# Altium project DAF DIP-4 PCB.PrjPcb
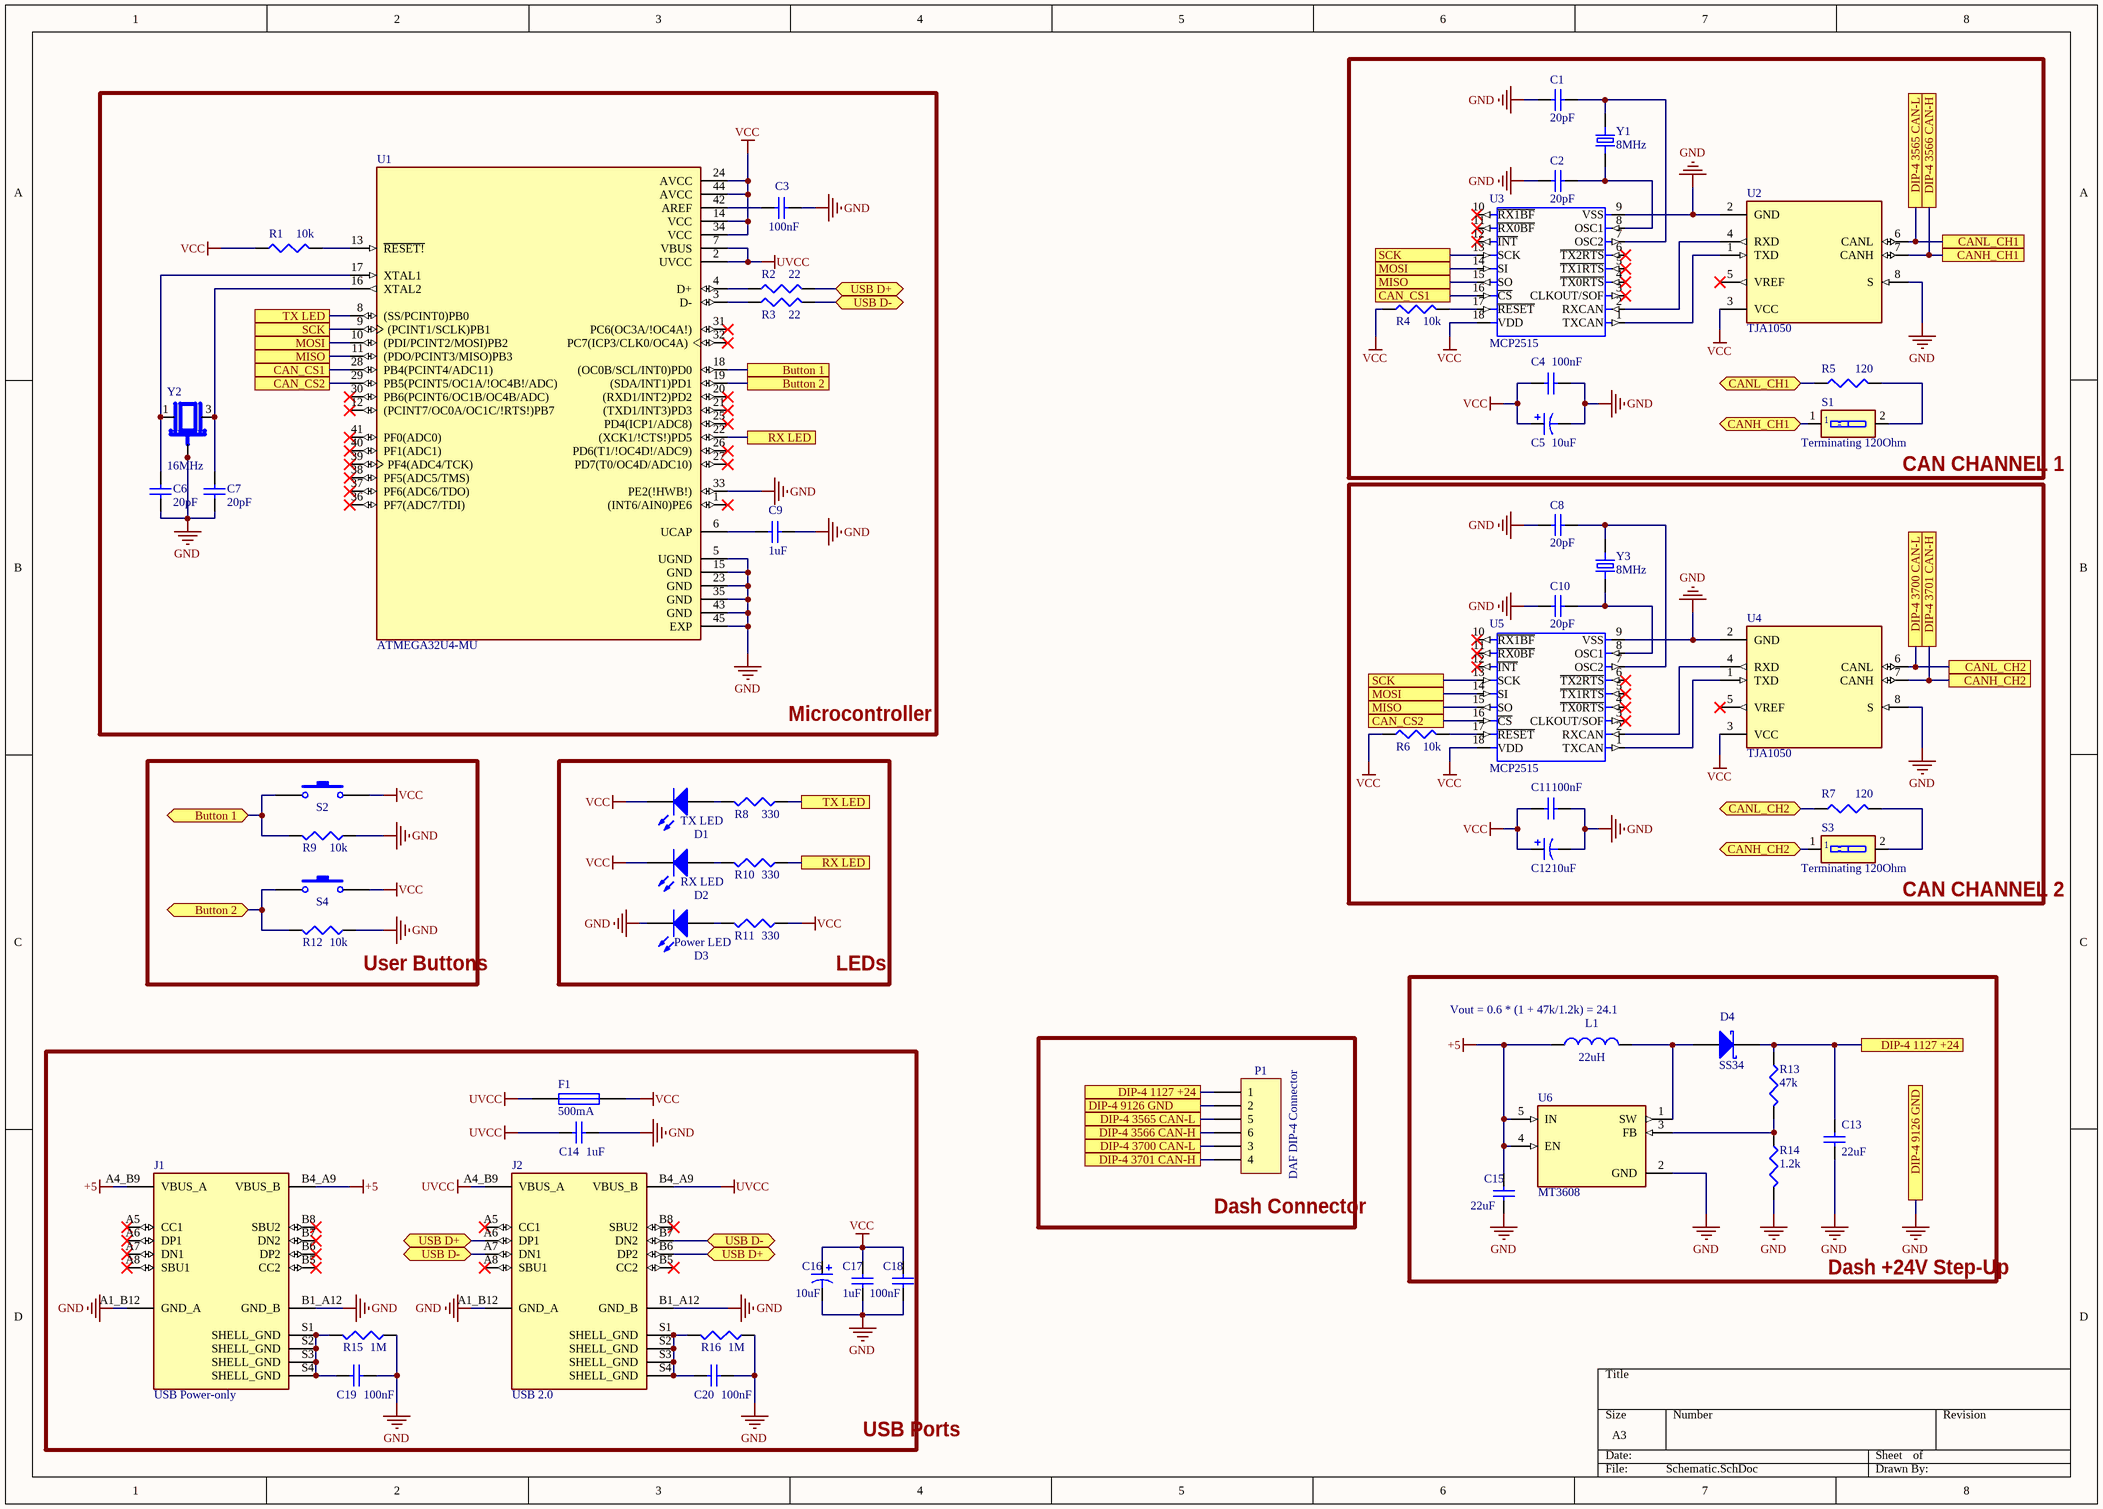
[diagram p0: Schematic.SchDoc]
1 sheet, 58 parts. Net scope: flat (ports and power ports of the same name join across sheets).
Board file: DAF DIP-4 PCB.PcbDoc

## Sheet Schematic.SchDoc: DAF DIP-4 Dashboard Controller
size A3; DrawnBy: Nazar Diadiun; SheetNumber: 1; SheetTotal: 1

### Parts
C1  value 20pF  [C0805]  (hidden comment: Cap)
C2  value 20pF  [C0805]  (hidden comment: Cap)
C3  value 100nF  [C0805]  (hidden comment: Cap)
C4  value 100nF  [C0805]  (hidden comment: Cap)
C5  value 10uF  [C1206]  (hidden comment: Cap Pol3)
C6  value 20pF  [C0805]  (hidden comment: Cap)
C7  value 20pF  [C0805]  (hidden comment: Cap)
C8  value 20pF  [C0805]  (hidden comment: Cap)
C9  value 1uF  [C0805]  (hidden comment: Cap)
C10  value 20pF  [C0805]  (hidden comment: Cap)
C11  value 100nF  [C0805]  (hidden comment: Cap)
C12  value 10uF  [C1206]  (hidden comment: Cap Pol3)
C13  value 22uF  [C1206]  (hidden comment: Cap)
C14  value 1uF  [C0805]  (hidden comment: Cap)
C15  value 22uF  [C1206]  (hidden comment: Cap)
C16  value 10uF  [C1206]  (hidden comment: Cap Pol3)
C17  value 1uF  [C0805]  (hidden comment: Cap)
C18  value 100nF  [C0805]  (hidden comment: Cap)
C19  value 100nF  [C0805]  (hidden comment: Cap)
C20  value 100nF  [C0805]  (hidden comment: Cap)
D1  TX LED  [6-0805_L]
D2  RX LED  [6-0805_L]
D3  Power LED  [6-0805_L]
D4  SS34  [SMC]
F1  500mA  [C1206]
J1  USB Power-only  [GCT_USB4505-03-0-A_REVA]
J2  USB 2.0  [GCT_USB4505-03-0-A_REVA]
L1  value 22uH  [IND_#B966BS-220M=P3]  (hidden comment: Inductor)
P1  DAF DIP-4 Connector  [HDR1X6]
R1  value 10k  [6-0805_L]  (hidden comment: Res3)
R2  value 22  [J1-0603]  (hidden comment: Res3)
R3  value 22  [J1-0603]  (hidden comment: Res3)
R4  value 10k  [6-0805_L]  (hidden comment: Res3)
R5  value 120  [6-0805_L]  (hidden comment: Res3)
R6  value 10k  [6-0805_L]  (hidden comment: Res3)
R7  value 120  [6-0805_L]  (hidden comment: Res3)
R8  value 330  [6-0805_L]  (hidden comment: Res3)
R9  value 10k  [6-0805_L]  (hidden comment: Res3)
R10  value 330  [6-0805_L]  (hidden comment: Res3)
R11  value 330  [6-0805_L]  (hidden comment: Res3)
R12  value 10k  [6-0805_L]  (hidden comment: Res3)
R13  value 47k  [6-0805_L]  (hidden comment: Res3)
R14  value 1.2k  [6-0805_L]  (hidden comment: Res3)
R15  value 1M  [6-0805_L]  (hidden comment: Res3)
R16  value 1M  [6-0805_L]  (hidden comment: Res3)
S1  Terminating 120Ohm  [SW_5161390-1]
S2  SW-PB  [SW_147873-2]  (value not drawn)
S3  Terminating 120Ohm  [SW_5161390-1]
S4  SW-PB  [SW_147873-2]  (value not drawn)
U1  ATMEGA32U4-MU  [QFN50P700X700X100-45N]
U2  TJA1050  [SOIC127P600X175-8N]
U3  MCP2515  [SOIC18-1.27-11.5X7.5MM]
U4  TJA1050  [SOIC127P600X175-8N]
U5  MCP2515  [SOIC18-1.27-11.5X7.5MM]
U6  MT3608  [SOT95P280X145-6N]
Y1  8MHz  [XTAL_ECS-135-S-1]
Y2  16MHz  [OSC_ABM3B-16.000MHZ-D-1-X-T]
Y3  8MHz  [XTAL_ECS-135-S-1]

### Blocks framed on the sheet
CAN CHANNEL 1: C1 C2 C4 C5 R4 R5 S1 U2 U3 Y1
Microcontroller: C3 C6 C7 C9 R1-R3 U1 Y2
User Buttons: R9 R12 S2 S4
LEDs: D1-D3 R8 R10 R11
Dash +24V Step-Up: C13 C15 D4 L1 R13 R14 U6
Dash Connector: P1
USB Ports: C14 C16-C20 F1 J1 J2 R15 R16

### Ports
Button 1, Button 1 (bidir), Button 2, Button 2 (bidir), CAN_CS1, CAN_CS2, CANH_CH1, CANH_CH1 (bidir), CANH_CH2, CANH_CH2 (bidir), CANL_CH1, CANL_CH1 (bidir), CANL_CH2, CANL_CH2 (bidir), DIP-4 1127 +24, DIP-4 3565 CAN-L, DIP-4 3566 CAN-H, DIP-4 3700 CAN-L, DIP-4 3701 CAN-H, DIP-4 9126 GND, MISO, MOSI, RX LED, SCK, TX LED, USB D+ (bidir), USB D- (bidir)

### Nets
+5: C15.2 J1.A4_B9(VBUS_A) J1.B4_A9(VBUS_B) L1.1 U6.4(EN) U6.5(IN)
GND: C1.1 C2.1 C3.1 C4.2 C5.2 C6.1 C7.1 C8.1 C9.1 C10.1 C11.2 C12.2 C13.1 C14.1 C15.1 C16.2 C17.1 C18.1 C19.2 C20.2 D3.2(K) J1.A1_B12(GND_A) J1.B1_A12(GND_B) J2.A1_B12(GND_A) J2.B1_A12(GND_B) P1.2 R9.1 R12.1 R14.2 R15.1 R16.1 U1.5(UGND) U1.15(GND) U1.23(GND) U1.33(PE2(!HWB!)) U1.35(GND) U1.43(GND) U1.45(EXP) U2.2(GND) U2.8(S) U3.9(VSS) U4.2(GND) U4.8(S) U5.9(VSS) U6.2(GND) Y2.2(GND) Y2.4(GND) ; port DIP-4 9126 GND
UVCC: C14.2 F1.1 J2.A4_B9(VBUS_A) J2.B4_A9(VBUS_B) U1.2(UVCC) U1.7(VBUS)
VCC: C4.1 C5.1 C11.1 C12.1 C16.1 C17.2 C18.2 D1.2(K) D2.2(K) F1.2 R1.1 R4.1 R6.1 R11.1 S2.2 S4.2 U1.14(VCC) U1.24(AVCC) U1.34(VCC) U1.44(AVCC) U2.3(VCC) U3.18(VDD) U4.3(VCC) U5.18(VDD)
NetC1_2: C1.2 U3.7(OSC2) Y1.1
NetC2_2: C2.2 U3.8(OSC1) Y1.2
NetC3_2: C3.2 U1.42(AREF)
NetC6_2: C6.2 U1.17(XTAL1) Y2.1
NetC7_2: C7.2 U1.16(XTAL2) Y2.3
NetC8_2: C8.2 U5.7(OSC2) Y3.1
NetC9_2: C9.2 U1.6(UCAP)
NetC10_2: C10.2 U5.8(OSC1) Y3.2
NetC13_2: C13.2 D4.2(K) P1.1 R13.1 ; port DIP-4 1127 +24
NetC19_1: C19.1 J1.S1(SHELL_GND) J1.S2(SHELL_GND) J1.S3(SHELL_GND) J1.S4(SHELL_GND) R15.2
NetC20_1: C20.1 J2.S1(SHELL_GND) J2.S2(SHELL_GND) J2.S3(SHELL_GND) J2.S4(SHELL_GND) R16.2
NetD1_1: D1.1(A) R8.2
NetD2_1: D2.1(A) R10.2
NetD3_1: D3.1(A) R11.2
NetD4_1: D4.1(A) L1.2 U6.1(SW)
NetJ2_A6: J2.A6(DP1) J2.B6(DP2) R2.2 ; port USB D+
NetJ2_A7: J2.A7(DN1) J2.B7(DN2) R3.2 ; port USB D-
NetP1_3: P1.3 R7.1 U4.6(CANL) ; port CANL_CH2, port DIP-4 3700 CAN-L
NetP1_4: P1.4 S3.1 U4.7(CANH) ; port CANH_CH2, port DIP-4 3701 CAN-H
NetP1_5: P1.5 R5.1 U2.6(CANL) ; port CANL_CH1, port DIP-4 3565 CAN-L
NetP1_6: P1.6 S1.1 U2.7(CANH) ; port CANH_CH1, port DIP-4 3566 CAN-H
NetR1_2: R1.2 U1.13(~{RESET!})
NetR2_1: R2.1 U1.4(D+)
NetR3_1: R3.1 U1.3(D-)
NetR4_2: R4.2 U3.17(~{RESET})
NetR5_2: R5.2 S1.2
NetR6_2: R6.2 U5.17(~{RESET})
NetR7_2: R7.2 S3.2
NetR8_1: R8.1 U1.8((SS/PCINT0)PB0) ; port TX LED
NetR9_2: R9.2 S2.1 U1.18((OC0B/SCL/INT0)PD0) ; port Button 1
NetR10_1: R10.1 U1.22((XCK1/!CTS!)PD5) ; port RX LED
NetR12_2: R12.2 S4.1 U1.19((SDA/INT1)PD1) ; port Button 2
NetR13_2: R13.2 R14.1 U6.3(FB)
NetU1_9: U1.9((PCINT1/SCLK)PB1) U3.13(SCK) U5.13(SCK) ; port SCK
NetU1_10: U1.10((PDI/PCINT2/MOSI)PB2) U3.14(SI) U5.14(SI) ; port MOSI
NetU1_11: U1.11((PDO/PCINT3/MISO)PB3) U3.15(SO) U5.15(SO) ; port MISO
NetU1_28: U1.28(PB4(PCINT4/ADC11)) U3.16(~{CS}) ; port CAN_CS1
NetU1_29: U1.29(PB5(PCINT5/OC1A/!OC4B!/ADC)) U5.16(~{CS}) ; port CAN_CS2
NetU2_1: U2.1(TXD) U3.1(TXCAN)
NetU2_4: U2.4(RXD) U3.2(RXCAN)
NetU4_1: U4.1(TXD) U5.1(TXCAN)
NetU4_4: U4.4(RXD) U5.2(RXCAN)

Not connected (* = marked no-connect by the designer): J1 A5(CC1)* A6(DP1)* A7(DN1)* A8(SBU1)* B5(CC2)* B6(DP2)* B7(DN2)* B8(SBU2)*; J2 A5(CC1)* A8(SBU1)* B5(CC2)* B8(SBU2)*; U1 1((INT6/AIN0)PE6)* 12((PCINT7/OC0A/OC1C/!RTS!)PB7)* 20((RXD1/INT2)PD2)* 21((TXD1/INT3)PD3)* 25(PD4(ICP1/ADC8))* 26(PD6(T1/!OC4D!/ADC9))* 27(PD7(T0/OC4D/ADC10))* 30(PB6(PCINT6/OC1B/OC4B/ADC))* 31(PC6(OC3A/!OC4A!))* 32(PC7(ICP3/CLK0/OC4A))* 36(PF7(ADC7/TDI))* 37(PF6(ADC6/TDO))* 38(PF5(ADC5/TMS))* 39(PF4(ADC4/TCK))* 40(PF1(ADC1))* 41(PF0(ADC0))*; U2 5(VREF)*; U3 3(CLKOUT/SOF)* 4(~{TX0RTS})* 5(~{TX1RTS})* 6(~{TX2RTS})* 10(~{RX1BF})* 11(~{RX0BF})* 12(~{INT})*; U4 5(VREF)*; U5 3(CLKOUT/SOF)* 4(~{TX0RTS})* 5(~{TX1RTS})* 6(~{TX2RTS})* 10(~{RX1BF})* 11(~{RX0BF})* 12(~{INT})*

### Notes on the sheet
- (near S3) CAN CHANNEL 2
- (near L1) Vout = 0.6 * (1 + 47k/1.2k) = 24.1

### Library data of the parts
C1-C4 C6-C11 C13-C15 C17-C20 = Cap: Capacitor; Published: 8-Jun-2000; LatestRevisionDate: 17-Jul-2002; LatestRevisionNote: Re-released for DXP Platform.; PackageReference: RAD-0.3; Publisher: Altium Limited; PackageDescription: Radial Cap, Thru-Hole; 2 Leads; 0.3 in Pin Spacing
C5 C12 C16 = Cap Pol3: Polarized Capacitor (Surface Mount); Published: 8-Jun-2000; LatestRevisionDate: 29-May-2009; LatestRevisionNote: IPC-7351 Footprint Added.; PackageReference: C0805; Publisher: Altium Limited; PackageDescription: Chip Capacitor
D1-D3 = LED1: Typical RED GaAs LED; Published: 8-Jun-2000; LatestRevisionDate: 08-Jul-2005; LatestRevisionNote: Mech Layer 1 removed.; PackageReference: LED-1; Publisher: Altium Limited; PackageDescription: LED; 2 Leads
D4 = D Schottky: Schottky Diode; Published: 8-Jun-2000; LatestRevisionDate: 17-Jul-2002; LatestRevisionNote: Re-released for DXP Platform.; PackageReference: SMB; Publisher: Altium Limited; PackageDescription: DO-214-AA/SMB; 2 C-Bend Leads; Body 5.3 x 3.6 mm, inc. leads (LxW); Code_JEDEC: DO-214-AA
F1 = Fuse 1: Fuse; Published: 8-Jun-2000; LatestRevisionDate: 17-Jul-2002; LatestRevisionNote: Re-released for DXP Platform.; PackageReference: PIN-W2/E2.8; Publisher: Altium Limited; PackageDescription: Thru-Hole; 2 Leads
J1 J2 = USB4505-03-0-A_REVA: USB-C (USB TYPE-C) USB 2.0 Receptacle Connector 24 (16+8 Dummy) Position Board Edge, Cutout; Surface Mount; Through Hole, Right Angle; MF: Global Connector Technology; Price: None; SnapEDA_Link: https://www.snapeda.com/parts/USB4505-03-0-A/Global+Connector+Technology/view-part/?ref=snap; Purchase-URL: https://pricing.snapeda.com/search/part/USB4505-03-0-A/?ref=eda; MP: USB4505-03-0-A; Value: *; Availability: In Stock; Package: None; Check_prices: https://www.snapeda.com/parts/USB4505-03-0-A/Global+Connector+Technology/view-part/?ref=eda
L1 = Inductor: Code_IEC: 1005; Published: 8-Jun-2000; LatestRevisionDate: 29-May-2009; LatestRevisionNote: IPC-7351 Footprint Added.; PackageReference: 0402-A; Publisher: Altium Limited; PackageDescription: Chip Inductor; Code_JEITA: 0402
P1 = Header 6: Header, 6-Pin; LatestRevisionDate: 17-Jul-2002; LatestRevisionNote: Re-released for DXP Platform.; Publisher: Altium Limited
R1-R16 = Res3: Resistor; Published: 8-Jun-2000; LatestRevisionDate: 29-May-2009; LatestRevisionNote: IPC-7351 Footprint Added.; PackageReference: J1-0603; Publisher: Altium Limited; PackageDescription: Chip Resistor
S1 S3 = 5161390-1: Switch DIP OFF ON SPST 1 Top Slide 25A 50VDC PC Pins 2.54mm Thru-Hole Box/Carton; MF: TE Connectivity; TE_purchase_URL: https://www.te.com/usa-en/product-5161390-1.html?te_bu=Cor&te_type=disp&te_campaign=seda_glo_cor-seda-global-disp-prtnr-fy19-seda-model-bom-cta_sma-317_1&elqCampaignId=32493; Package: None; SnapEDA_Link: https://www.snapeda.com/parts/5161390-1/TE%20Connectivity%20ALCOSWITCH%20Switches/view-part/1375142/?ref=snap; MP: 5161390-1; Value: *; Availability: Unavailable; EU_RoHS_Compliance: Compliant; Price: None
S2 S4 = SW-PB: Switch; Published: 24-Mar-1999; LatestRevisionDate: 17-Jul-2002; LatestRevisionNote: Re-released for DXP Platform.; PackageReference: SPST-2; Publisher: Altium Limited; PackageDescription: Switch; 2 Leads
U1 = ATMEGA32U4-MU: AVR AVRÂ® ATmega Microcontroller IC 8-Bit 16MHz 32KB (16K x 16) FLASH 44-VQFN (7x7); MF: Microchip Technology / Atmel; Value: *; SnapEDA_Link: https://www.snapeda.com/parts/ATMEGA32U4-MU/Atmel/view-part/4702009/?ref=snap; Purchase-URL: https://pricing.snapeda.com/search/part/ATMEGA32U4-MU/?ref=eda; Price: None; Availability: Good; Package: VFQFN-44 Microchip Technology / Atmel; MP: ATMEGA32U4-MU; Check_prices: https://www.snapeda.com/parts/ATMEGA32U4-MU/Atmel/view-part/4702009/?ref=eda
U2 U4 = TJA1050T/CM,118: 1/1 Transceiver Half CANbus 8-SO; MF: NXP USA; SnapEDA_Link: https://www.snapeda.com/parts/TJA1050T/CM,118/NXP%20USA%20Inc./view-part/304529/?ref=snap; Value: *; Purchase-URL: https://pricing.snapeda.com/search/part/TJA1050T/CM,118/?ref=eda; Check_prices: https://www.snapeda.com/parts/TJA1050T/CM,118/NXP%20USA%20Inc./view-part/304529/?ref=eda; Price: None; Availability: In Stock; MP: TJA1050T/CM,118; Package: SO-8 NXP Semiconductors
U3 U5 = INTERFACE-MCP2515T-I/SO(SOIC18): IC CAN CONTROLLER W/SPI 18SOIC; MF: Microchip Technology; SnapEDA_Link: https://www.snapeda.com/parts/MCP2515T-I/SO/Atmel/view-part/4793276/?ref=snap; MP: MCP2515T-I/SO; Price: None; Package: None; Value: *; Availability: Unavailable
U6 = MT3608: High Efficiency 1.2MHz2A Step Up Converter; MF: Aerosemi Technology Co., Ltd; Package: Package Analog Devices; Availability: Unavailable; Value: *; MP: MT3608; SnapEDA_Link: https://www.snapeda.com/parts/MT3608/Aerosemi%20Technology%20Co.%2C%20Ltd/view-part/3218014/?ref=snap; Price: None
Y1 Y3 = ECS-135-S-1: Package: None; Price: None; Value: *; MP: ECS-135-S-1; Availability: Unavailable
Y2 = ABM3B-16.000MHZ-D-1-X-T: 16 MHz Â±10ppm Crystal 18pF 50 Ohms 4-SMD, No Lead; MF: ABRACON; Availability: In Stock; SnapEDA_Link: https://www.snapeda.com/parts/ABM3B-16.000MHZ-D-1-X-T/Abracon/view-part/?ref=snap; Package: SMD-4 Abracon LLC; MP: ABM3B-16.000MHZ-D-1-X-T; Value: *; Price: None; Purchase-URL: https://pricing.snapeda.com/search/part/ABM3B-16.000MHZ-D-1-X-T/?ref=eda; Check_prices: https://www.snapeda.com/parts/ABM3B-16.000MHZ-D-1-X-T/Abracon/view-part/?ref=eda